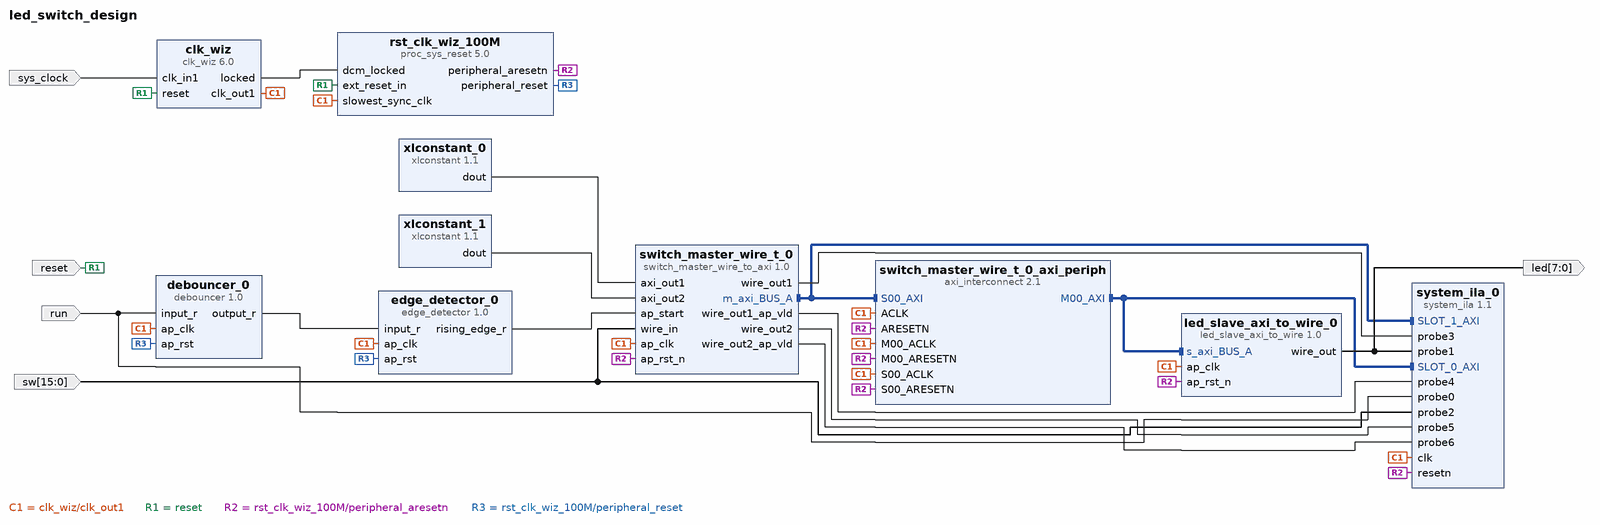
[diagram p0: block diagram of the top level]
# Vivado block design led_switch_design, xc7a35tcpg236-1, Vivado 2023.2
create_bd_design led_switch_design

create_bd_port -dir I -type clk sys_clock
set_property -dict {CONFIG.FREQ_HZ 100000000 CONFIG.PHASE 0.0} [get_bd_ports sys_clock]
create_bd_port -dir I -type rst reset
set_property -dict {CONFIG.POLARITY ACTIVE_HIGH} [get_bd_ports reset]
create_bd_port -dir I -type data run
create_bd_port -dir I -from 15 -to 0 -type data sw
create_bd_port -dir O -from 7 -to 0 -type data led

create_bd_cell -type ip -vlnv xilinx.com:hls:led_slave_axi_to_wire:1.0 led_slave_axi_to_wire_0
create_bd_cell -type ip -vlnv xilinx.com:hls:switch_master_wire_to_axi:1.0 switch_master_wire_t_0
create_bd_cell -type ip -vlnv xilinx.com:ip:clk_wiz:6.0 clk_wiz
set_property -dict [list \
  CONFIG.CLK_IN1_BOARD_INTERFACE sys_clock \
  CONFIG.RESET_BOARD_INTERFACE reset \
  CONFIG.USE_BOARD_FLOW true \
] [get_bd_cells clk_wiz]
create_bd_cell -type ip -vlnv xilinx.com:ip:proc_sys_reset:5.0 rst_clk_wiz_100M
set_property -dict {CONFIG.RESET_BOARD_INTERFACE reset CONFIG.USE_BOARD_FLOW true} [get_bd_cells rst_clk_wiz_100M]
create_bd_cell -type ip -vlnv xilinx.com:ip:axi_interconnect:2.1 switch_master_wire_t_0_axi_periph
set_property -dict {CONFIG.NUM_MI 1} [get_bd_cells switch_master_wire_t_0_axi_periph]
create_bd_cell -type ip -vlnv xilinx.com:ip:xlconstant:1.1 xlconstant_0
set_property -dict {CONFIG.CONST_VAL 0x10 CONFIG.CONST_WIDTH 64} [get_bd_cells xlconstant_0]
create_bd_cell -type ip -vlnv xilinx.com:ip:xlconstant:1.1 xlconstant_1
set_property -dict {CONFIG.CONST_VAL 0x18 CONFIG.CONST_WIDTH 64} [get_bd_cells xlconstant_1]
create_bd_cell -type ip -vlnv xilinx.com:hls:debouncer:1.0 debouncer_0
create_bd_cell -type ip -vlnv xilinx.com:hls:edge_detector:1.0 edge_detector_0
create_bd_cell -type ip -vlnv xilinx.com:ip:system_ila:1.1 system_ila_0
set_property -dict [list \
  CONFIG.C_ADV_TRIGGER true \
  CONFIG.C_EN_STRG_QUAL 1 \
  CONFIG.C_MON_TYPE MIX \
  CONFIG.C_NUM_MONITOR_SLOTS 2 \
  CONFIG.C_NUM_OF_PROBES 7 \
  CONFIG.C_PROBE0_TYPE 0 \
  CONFIG.C_PROBE1_TYPE 0 \
  CONFIG.C_PROBE2_TYPE 0 \
  CONFIG.C_PROBE3_TYPE 0 \
  CONFIG.C_PROBE4_TYPE 0 \
  CONFIG.C_PROBE5_TYPE 0 \
  CONFIG.C_PROBE6_TYPE 0 \
  CONFIG.C_SLOT_0_APC_EN 0 \
  CONFIG.C_SLOT_0_AXI_AR_SEL_DATA 1 \
  CONFIG.C_SLOT_0_AXI_AR_SEL_TRIG 1 \
  CONFIG.C_SLOT_0_AXI_AW_SEL_DATA 1 \
  CONFIG.C_SLOT_0_AXI_AW_SEL_TRIG 1 \
  CONFIG.C_SLOT_0_AXI_B_SEL_DATA 1 \
  CONFIG.C_SLOT_0_AXI_B_SEL_TRIG 1 \
  CONFIG.C_SLOT_0_AXI_R_SEL_DATA 1 \
  CONFIG.C_SLOT_0_AXI_R_SEL_TRIG 1 \
  CONFIG.C_SLOT_0_AXI_W_SEL_DATA 1 \
  CONFIG.C_SLOT_0_AXI_W_SEL_TRIG 1 \
  CONFIG.C_SLOT_0_INTF_TYPE xilinx.com:interface:aximm_rtl:1.0 \
  CONFIG.C_SLOT_1_APC_EN 0 \
  CONFIG.C_SLOT_1_AXI_AR_SEL_DATA 0 \
  CONFIG.C_SLOT_1_AXI_AR_SEL_TRIG 0 \
  CONFIG.C_SLOT_1_AXI_AW_SEL_DATA 1 \
  CONFIG.C_SLOT_1_AXI_AW_SEL_TRIG 1 \
  CONFIG.C_SLOT_1_AXI_B_SEL_DATA 1 \
  CONFIG.C_SLOT_1_AXI_B_SEL_TRIG 1 \
  CONFIG.C_SLOT_1_AXI_R_SEL_DATA 0 \
  CONFIG.C_SLOT_1_AXI_R_SEL_TRIG 0 \
  CONFIG.C_SLOT_1_AXI_W_SEL_DATA 1 \
  CONFIG.C_SLOT_1_AXI_W_SEL_TRIG 1 \
  CONFIG.C_SLOT_1_INTF_TYPE xilinx.com:interface:aximm_rtl:1.0 \
] [get_bd_cells system_ila_0]

# ---- connections ----

connect_bd_intf_net -intf_net switch_master_wire_t_0_axi_periph_M00_AXI [get_bd_intf_pins switch_master_wire_t_0_axi_periph/M00_AXI] [get_bd_intf_pins led_slave_axi_to_wire_0/s_axi_BUS_A]
connect_bd_intf_net [get_bd_intf_pins switch_master_wire_t_0_axi_periph/M00_AXI] [get_bd_intf_pins system_ila_0/SLOT_0_AXI]
connect_bd_intf_net -intf_net switch_master_wire_t_0_m_axi_BUS_A [get_bd_intf_pins switch_master_wire_t_0/m_axi_BUS_A] [get_bd_intf_pins switch_master_wire_t_0_axi_periph/S00_AXI]
connect_bd_intf_net [get_bd_intf_pins switch_master_wire_t_0/m_axi_BUS_A] [get_bd_intf_pins system_ila_0/SLOT_1_AXI]
connect_bd_net [get_bd_pins clk_wiz/clk_out1] \
  [get_bd_pins rst_clk_wiz_100M/slowest_sync_clk] [get_bd_pins led_slave_axi_to_wire_0/ap_clk] \
  [get_bd_pins switch_master_wire_t_0_axi_periph/ACLK] [get_bd_pins switch_master_wire_t_0_axi_periph/S00_ACLK] \
  [get_bd_pins switch_master_wire_t_0_axi_periph/M00_ACLK] [get_bd_pins debouncer_0/ap_clk] \
  [get_bd_pins edge_detector_0/ap_clk] [get_bd_pins system_ila_0/clk] [get_bd_pins switch_master_wire_t_0/ap_clk]
connect_bd_net [get_bd_pins clk_wiz/locked] [get_bd_pins rst_clk_wiz_100M/dcm_locked]
connect_bd_net [get_bd_pins debouncer_0/output_r] [get_bd_pins edge_detector_0/input_r]
connect_bd_net [get_bd_pins edge_detector_0/rising_edge_r] [get_bd_pins switch_master_wire_t_0/ap_start]
connect_bd_net -net input_r_0_1 [get_bd_ports run] [get_bd_pins debouncer_0/input_r] [get_bd_pins system_ila_0/probe0]
connect_bd_net -net led_slave_axi_to_wire_0_wire_out [get_bd_pins led_slave_axi_to_wire_0/wire_out] \
  [get_bd_ports led] [get_bd_pins system_ila_0/probe1]
connect_bd_net [get_bd_ports reset] [get_bd_pins clk_wiz/reset] [get_bd_pins rst_clk_wiz_100M/ext_reset_in]
connect_bd_net [get_bd_pins rst_clk_wiz_100M/peripheral_aresetn] \
  [get_bd_pins led_slave_axi_to_wire_0/ap_rst_n] [get_bd_pins switch_master_wire_t_0_axi_periph/S00_ARESETN] \
  [get_bd_pins switch_master_wire_t_0_axi_periph/M00_ARESETN] [get_bd_pins switch_master_wire_t_0_axi_periph/ARESETN] \
  [get_bd_pins system_ila_0/resetn] [get_bd_pins switch_master_wire_t_0/ap_rst_n]
connect_bd_net [get_bd_pins rst_clk_wiz_100M/peripheral_reset] [get_bd_pins debouncer_0/ap_rst] [get_bd_pins edge_detector_0/ap_rst]
connect_bd_net [get_bd_ports sys_clock] [get_bd_pins clk_wiz/clk_in1]
connect_bd_net -net wire_in_0_1 [get_bd_ports sw] [get_bd_pins system_ila_0/probe2] [get_bd_pins switch_master_wire_t_0/wire_in]
connect_bd_net -net wire_out1 [get_bd_pins switch_master_wire_t_0/wire_out1] [get_bd_pins system_ila_0/probe3]
connect_bd_net -net wire_out1_ap_vld [get_bd_pins switch_master_wire_t_0/wire_out1_ap_vld] [get_bd_pins system_ila_0/probe4]
connect_bd_net -net wire_out2 [get_bd_pins switch_master_wire_t_0/wire_out2] [get_bd_pins system_ila_0/probe5]
connect_bd_net -net wire_out2_ap_vld [get_bd_pins switch_master_wire_t_0/wire_out2_ap_vld] [get_bd_pins system_ila_0/probe6]
connect_bd_net [get_bd_pins xlconstant_0/dout] [get_bd_pins switch_master_wire_t_0/axi_out1]
connect_bd_net [get_bd_pins xlconstant_1/dout] [get_bd_pins switch_master_wire_t_0/axi_out2]
set_property HDL_ATTRIBUTE.DEBUG true [get_bd_intf_nets switch_master_wire_t_0_axi_periph_M00_AXI]
set_property HDL_ATTRIBUTE.MARK_DEBUG true [get_bd_intf_nets switch_master_wire_t_0_axi_periph_M00_AXI]
set_property HDL_ATTRIBUTE.DEBUG true [get_bd_intf_nets switch_master_wire_t_0_m_axi_BUS_A]
set_property HDL_ATTRIBUTE.MARK_DEBUG true [get_bd_intf_nets switch_master_wire_t_0_m_axi_BUS_A]
set_property HDL_ATTRIBUTE.DEBUG true [get_bd_nets input_r_0_1]
set_property HDL_ATTRIBUTE.MARK_DEBUG true [get_bd_nets input_r_0_1]
set_property HDL_ATTRIBUTE.DEBUG true [get_bd_nets led_slave_axi_to_wire_0_wire_out]
set_property HDL_ATTRIBUTE.MARK_DEBUG true [get_bd_nets led_slave_axi_to_wire_0_wire_out]
set_property HDL_ATTRIBUTE.DEBUG true [get_bd_nets wire_in_0_1]
set_property HDL_ATTRIBUTE.MARK_DEBUG true [get_bd_nets wire_in_0_1]
set_property HDL_ATTRIBUTE.DEBUG true [get_bd_nets wire_out1]
set_property HDL_ATTRIBUTE.MARK_DEBUG true [get_bd_nets wire_out1]
set_property HDL_ATTRIBUTE.DEBUG true [get_bd_nets wire_out1_ap_vld]
set_property HDL_ATTRIBUTE.MARK_DEBUG true [get_bd_nets wire_out1_ap_vld]
set_property HDL_ATTRIBUTE.DEBUG true [get_bd_nets wire_out2]
set_property HDL_ATTRIBUTE.MARK_DEBUG true [get_bd_nets wire_out2]
set_property HDL_ATTRIBUTE.DEBUG true [get_bd_nets wire_out2_ap_vld]
set_property HDL_ATTRIBUTE.MARK_DEBUG true [get_bd_nets wire_out2_ap_vld]

# ---- address map ----
assign_bd_address -offset 0x0000000000000000 -range 64K -target_address_space [get_bd_addr_spaces switch_master_wire_t_0/Data_m_axi_BUS_A] [get_bd_addr_segs led_slave_axi_to_wire_0/s_axi_BUS_A/Reg]

validate_bd_design
save_bd_design
